# Altium schematic sheet Light.SchDoc
size A
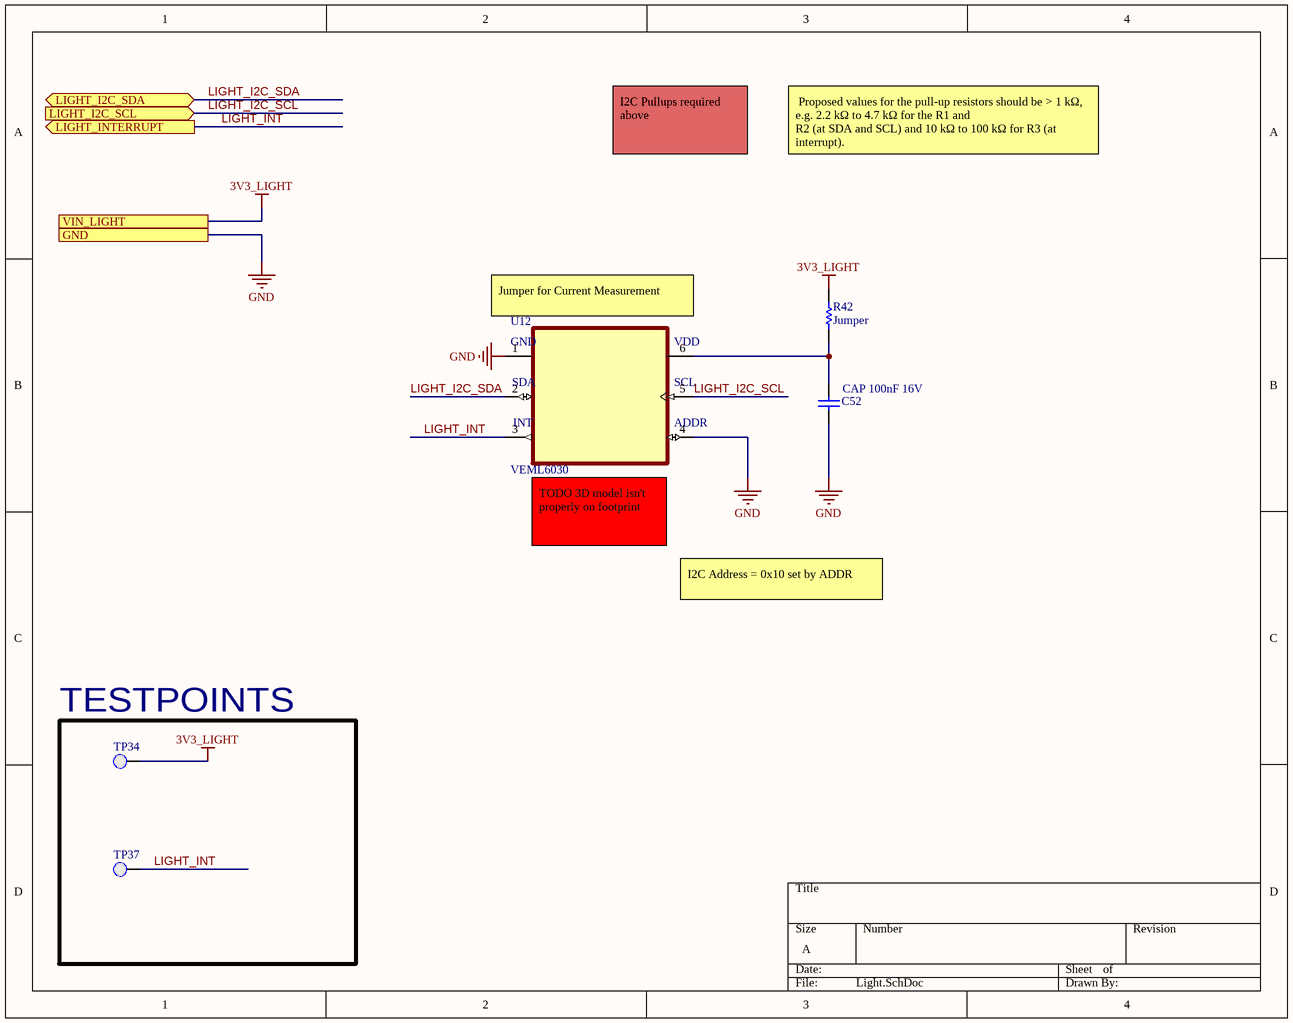
[diagram p0: Light.SchDoc]

## Parts
C52  CAP 100nF 16V  [CAPC0402(1005)60_M]
R42  Jumper  [RESC0805(2012)_N]
TP34  0.1" Pad  [PCBComponent]  (value not drawn)
TP37  0.1" Pad  [PCBComponent]  (value not drawn)
U12  VEML6030  [VISHAY_VEML6030_2X2X0.87]

## Blocks framed on the sheet
TESTPOINTS: TP34 TP37

## Ports
GND, LIGHT_I2C_SCL (in), LIGHT_I2C_SDA (bidir), LIGHT_INTERRUPT (out), VIN_LIGHT

## Nets
3V3_LIGHT: R42.1 TP34.1(PAD) ; port VIN_LIGHT
GND: C52.1 U12.1(GND) U12.4(ADDR) ; port GND
LIGHT_I2C_SCL: U12.5(SCL) ; port LIGHT_I2C_SCL
LIGHT_I2C_SDA: U12.2(SDA) ; port LIGHT_I2C_SDA
LIGHT_INT: TP37.1(PAD) U12.3(INT) ; port LIGHT_INTERRUPT
NetC52_2: C52.2 R42.2 U12.6(VDD)

## Notes on the sheet
- I2C Pullups required above
- Proposed values for the pull-up resistors should be > 1 kΩ, e.g. 2.2 kΩ to 4.7 kΩ for the R1 and
  R2 (at SDA and SCL) and 10 kΩ to 100 kΩ for R3 (at interrupt).
- (near U12) Jumper for Current Measurement
- (near U12) TODO 3D model isn't properly on footprint
- I2C Address = 0x10 set by ADDR

## Library data of the parts
C52 = CMP-1034-02069-1: CAP 100nF 16V ±10% 0402 (1005 Metric) Thickness 0.6mm SMD; Case-EIA: 0402; Case-Metric: 1005; Tolerance: Â±10%; Value: 100nF; Max Thickness: 0.6 mm; Rated Voltage: 16 V; Technology: SMT
R42 = CMP-1013-00001-1: Jumper 0805 (2012 Metric); Case-EIA: 0805; Value: 0.00 Ohm; Tolerance: None; Case-Metric: 2012; Technology: SMT; Power: None
TP34 TP37 = 0.1" Pad-A.4
U12 = VEML6030: Optical Sensor Ambient 550nm IÂ²C 6-SMD, No Lead; MF: Vishay; Value: *; Price: None; Package: SMD-6 Vishay; SnapEDA_Link: https://www.snapeda.com/parts/VEML6030/Vishay%20Semiconductor%20Opto%20Division/view-part/493148/?ref=snap; Availability: Unavailable; MP: VEML6030